# EasyEDA schematic esphaptc.json
TITLE: Sheet_1; REV: 1.0; Date: 2024-03-02; Sheet: 1/1; Company: Your Company
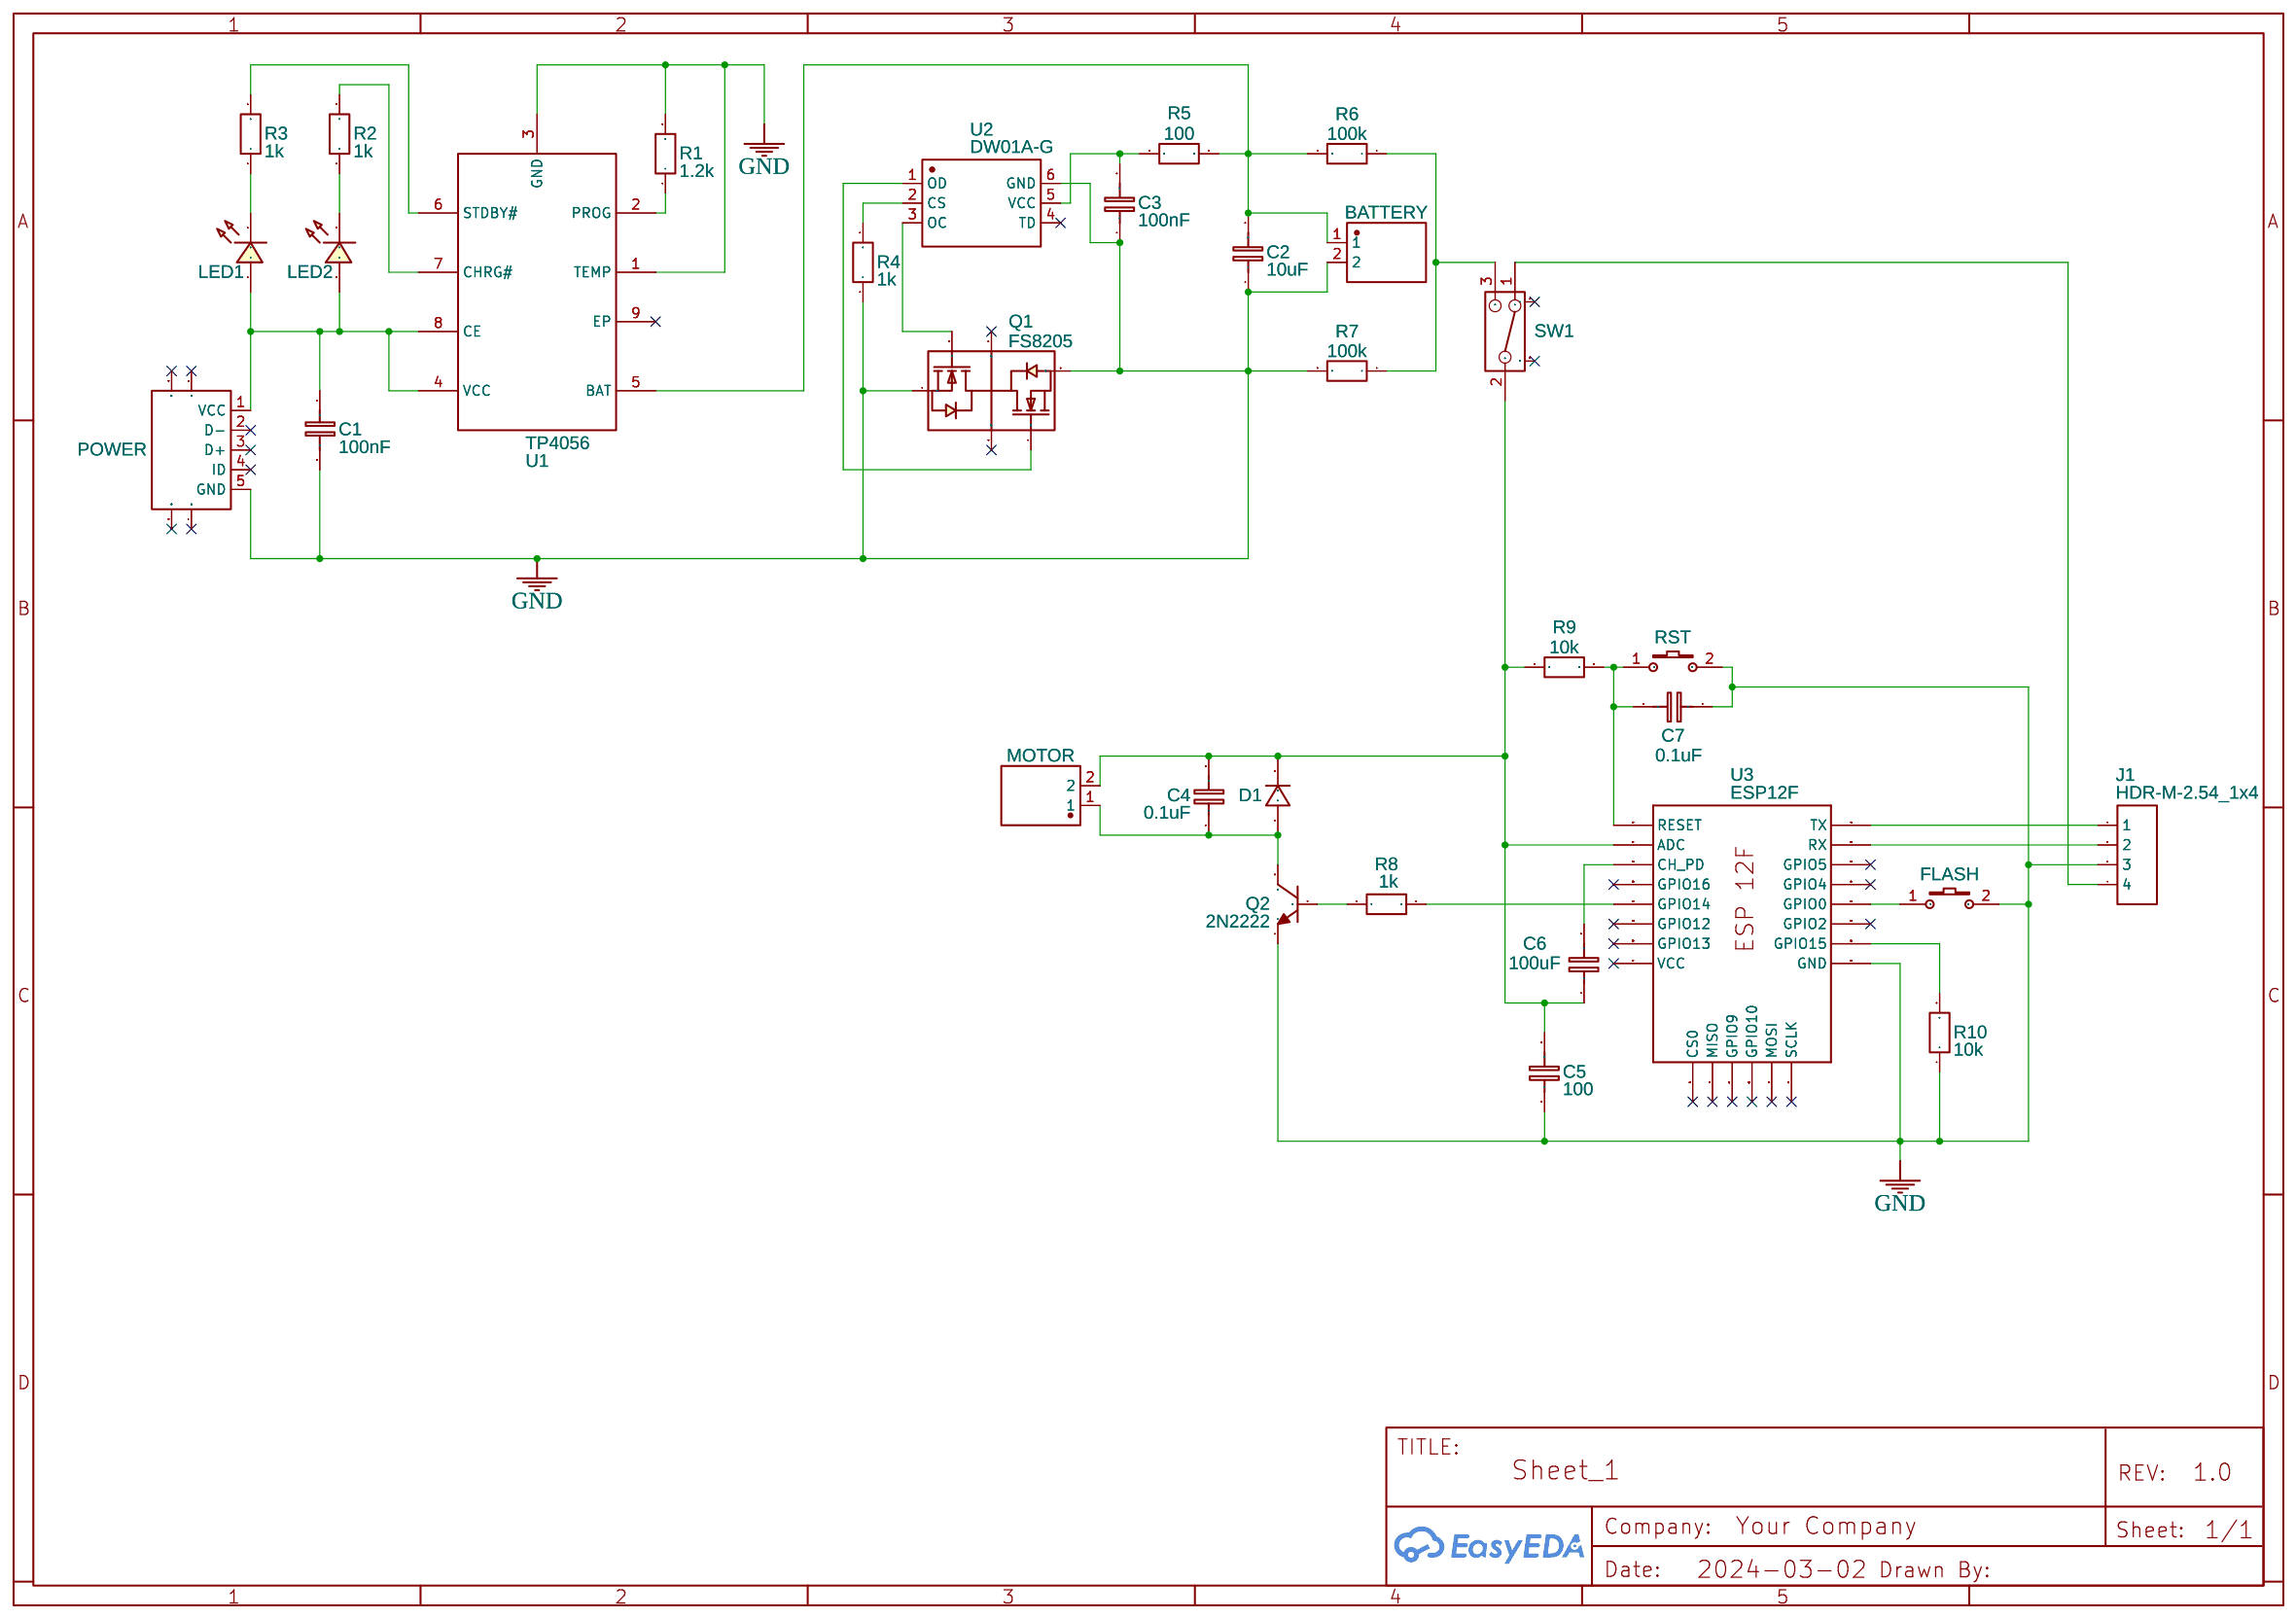
[diagram p0: schematic sheet]

## Parts
BATTERY  B02B-XASK-1-A(LF)(SN)  [CONN-TH_B02B-XASK-1-A-LF-SN]
C1  100nF  [C0603]
C2  10uF  [C0603]
C3  100nF  [C0603]
C4  0.1uF  [C0603]
C5  100  [C0603]
C6  100uF  [C0603]
C7  0.1uF  [C0603]
D1  1N4007W  [SOD-123_L2.8-W1.8-LS3.7-RD]
FLASH  K2-3.6×6.1_SMD  [KEY-SMD_2P-L6.2-W3.6-LS8.0]
J1  HDR-M-2.54_1x4  [HDR-M-2.54_1X4]
LED1  LED-0603_R  [LED0603_RED]
LED2  LED-0603_B  [LED0603_BLUE]
MOTOR  B02B-XASK-1-A(LF)(SN)  [CONN-TH_B02B-XASK-1-A-LF-SN]
POWER  USB-Micro_2  [MICRO-USB-SMD_5P_C40957]
Q1  FS8205  [SOT-23-6_L2.9-W1.6-P0.95-LS2.8-BR]
Q2  2N2222  [SOT-23-3_L2.9-W1.3-P1.90-LS2.4-TR]
R1  1.2k  [R0603]
R2  1k  [R0603]
R3  1k  [R0603]
R4  1k  [R0603]
R5  100  [R0603]
R6  100k  [R0603]
R7  100k  [R0603]
R8  1k  [R0603]
R9  10k  [R0603]
R10  10k  [R0603]
RST  K2-3.6×6.1_SMD  [KEY-SMD_2P-L6.2-W3.6-LS8.0]
SW1  SK-12D02-VG5  [SW-TH_SK-12D02VG3]
U1  TP4056  [ESOP-8_L4.9-W3.9-P1.27-LS6.0-BL-EP]
U2  DW01A-G  [SOT-23-6_L2.9-W1.6-P0.95-LS2.8-BR]
U3  ESP12F  [ESP12F-SMD]

## Library data of the parts
BATTERY MOTOR = B02B-XASK-1-A(LF)(SN): Contributor: LCSC; Supplier: LCSC; Supplier Part: C265077; Manufacturer: JST; JLCPCB Part Class: Extended Part
C1-C7 = C_0603_EU: Contributor: LCEDA_Lib
D1 = 1N4007W: Supplier: LCSC; Supplier Part: C328592; Manufacturer: BLUE ROCKET; Contributor: LCEDA_Lib
FLASH RST = K2-3.6×6.1_SMD: Supplier Part: C118141; Supplier: LCSC; Manufacturer Part: K2-1107ST-A4SW-06; Contributor: LCEDA_Lib; 制造商: 韩国韩荣
J1 = HDR-M-2.54_1x4: Supplier Part: C124378; Supplier: LCSC; Contributor: LCEDA_Lib
LED1 = LED-0603_R: Manufacturer: EVERLIGHT(台湾亿光); Manufacturer Part: 19-217/R6C-AL1M2VY/3T; Supplier Part: C72044; Supplier: LCSC; Contributor: LCEDA_01
LED2 = LED-0603_B: Manufacturer: EVERLIGHT(台湾亿光); Manufacturer Part: 19-217/BHC-ZL1M2RY/3T; Supplier Part: C72041; Supplier: LCSC; Contributor: LCEDA_01
POWER = USB-Micro_2: Supplier Part: C40957; Supplier: LCSC; Manufacturer: ValuePro; Contributor: LCEDA_Lib
Q1 = FS8205: Supplier: LCSC; Manufacturer: FORTUNE(富晶); Supplier Part: C32254; JLCPCB Part Class: Extended Part
Q2 = 2N3904(SOT-23): Supplier: LCSC; Manufacturer: KEC; Manufacturer Part: 2n3904S-RTK/PS; Supplier Part: C18536; Paste Type: SOT-23; Contributor: LCEDA_Lib
R1-R10 = R_0603_EU: Contributor: LCEDA_Lib
SW1 = SK-12D02-VG5: Supplier: LCSC; Supplier Part: C136722; Manufacturer: Rectangular Connectors - Contacts; Contributor: LCSC
U1 = TP4056: Contributor: Guest; Supplier: LCSC; Manufacturer: TOPPOWER(南京拓微); Manufacturer Part: TP4056-42-ESOP8; Supplier Part: C16581; JLCPCB Part Class: Extended Part
U2 = DW01A-G: Contributor: LCSC; Supplier: LCSC; Manufacturer: FORTUNE(富晶); Supplier Part: C61503; JLCPCB Part Class: Extended Part
U3 = ESP12F: Contributor: Hafsal

## Nets
GND: BATTERY.2 C1.2 C2.1 C3.1 C5.1 C7.1 FLASH.2 J1.3 POWER.5(GND) Q1.1(S1) Q1.3(S2) Q2.1(E) R1.2 R4.1 R7.2 R10.1 RST.2 U1.1(TEMP) U1.3(GND) U2.6(GND) U3.GND
Net-(BATTERY-1): BATTERY.1 C2.2 R5.2 R6.2 U1.5(BAT)
Net-(C1-1): C1.1 LED1.1 LED2.1 POWER.1(VCC) U1.4(VCC) U1.8(CE)
Net-(C3-2): C3.2 R5.1 U2.5(VCC)
Net-(C4-1): C4.1 D1.2 MOTOR.1 Q2.3(C)
Net-(C4-2): C4.2 C5.2 C6.1 D1.1 MOTOR.2 R9.1 SW1.2 U3.ADC
Net-(C6-2): C6.2 U3.CH_PD
Net-(C7-2): C7.2 R9.2 RST.1 U3.RESET
Net-(FLASH-1): FLASH.1 U3.GPIO0
Net-(J1-1): J1.1 U3.TXD0(TX)
Net-(J1-2): J1.2 U3.RXD0(RX)
Net-(J1-4): J1.4 SW1.1
Net-(LED1-2): LED1.2 R3.1
Net-(LED2-2): LED2.2 R2.1
Net-(Q1-4): Q1.4(G2) U2.1(OD)
Net-(Q1-6): Q1.6(G1) U2.3(OC)
Net-(Q2-2): Q2.2(B) R8.2
Net-(R1-1): R1.1 U1.2(PROG)
Net-(R2-2): R2.2 U1.7(CHRG#)
Net-(R3-2): R3.2 U1.6(STDBY#)
Net-(R4-2): R4.2 U2.2(CS)
Net-(R6-1): R6.1 R7.1 SW1.3
Net-(R8-1): R8.1 U3.GPIO14
Net-(R10-2): R10.2 U3.GPIO15

Not connected (* = marked no-connect by the designer): POWER 2(D-)* 3(D+)* 4(ID)* 6(SH3)* 7(SH4)* 8(SH1)* 9(SH2)*; Q1 2(D12)* 5(D12)*; SW1 4* 5*; U1 9(EP)*; U2 4(TD)*; U3 CS0* GPIO2* GPIO4* GPIO5* GPIO9* GPIO10* GPIO12* GPIO13* GPIO16* MISO* MOSI* SCLK* VCC*
